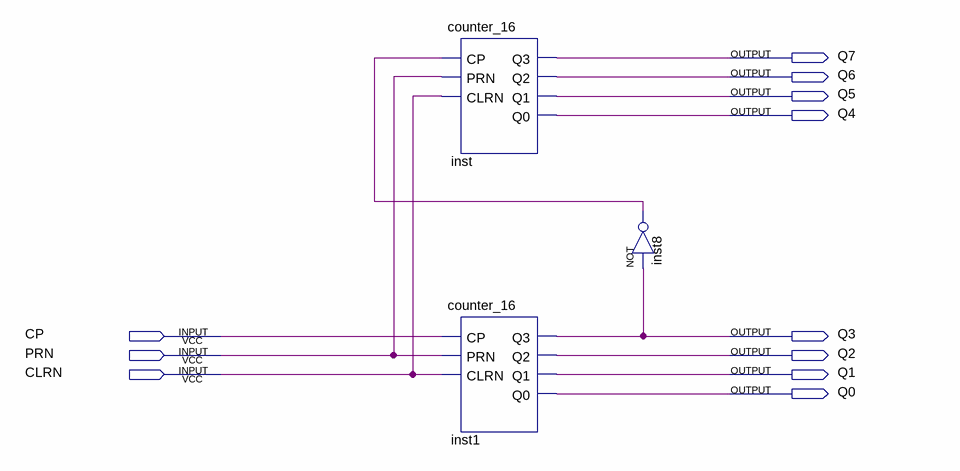
[diagram p0: schematic sheet]
// Quartus schematic counter_256.bdf as structural Verilog: 3 symbols, 11 pins
module counter_256 (
  input  CP,
  input  PRN,
  input  CLRN,
  output Q7,
  output Q6,
  output Q5,
  output Q4,
  output Q3,
  output Q2,
  output Q1,
  output Q0
);

  wire inst8_out;

  counter_16 inst (.CP(inst8_out), .PRN(PRN), .CLRN(CLRN), .Q3(Q7), .Q2(Q6), .Q1(Q5), .Q0(Q4));
  counter_16 inst1 (.CP(CP), .PRN(PRN), .CLRN(CLRN), .Q3(Q3), .Q2(Q2), .Q1(Q1), .Q0(Q0));
  not inst8 (inst8_out, Q3);
endmodule
